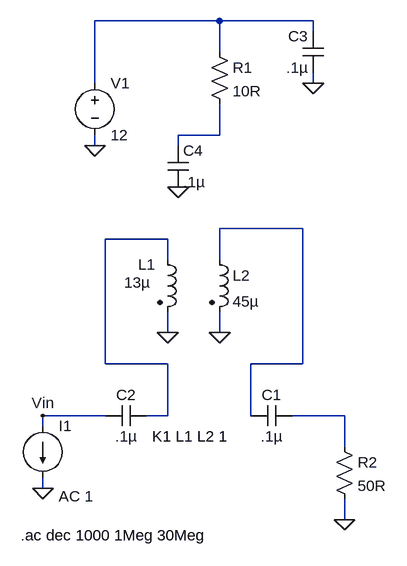
[diagram p0: schematic Transformer Z Matching.asc]
Transformer Z Matching.asc, the LTspice schematic file:
Version 4
SHEET 1 880 712
WIRE -16 -96 -208 -96
WIRE 128 -96 -16 -96
WIRE 128 -80 128 -96
WIRE -16 -48 -16 -96
WIRE -208 0 -208 -96
WIRE 128 0 128 -16
WIRE -16 80 -16 32
WIRE -16 80 -80 80
WIRE -208 96 -208 80
WIRE -80 96 -80 80
WIRE 112 224 -16 224
WIRE -96 240 -192 240
WIRE -96 272 -96 240
WIRE -16 272 -16 224
WIRE -96 384 -96 352
WIRE -16 384 -16 352
WIRE -192 432 -192 240
WIRE -96 432 -192 432
WIRE 112 432 112 224
WIRE 112 432 32 432
WIRE -192 512 -288 512
WIRE -96 512 -96 432
WIRE -96 512 -128 512
WIRE 32 512 32 432
WIRE 176 512 96 512
WIRE -288 528 -288 512
WIRE 176 560 176 512
WIRE -288 624 -288 608
WIRE 176 672 176 640
FLAG -208 96 0
FLAG 128 0 0
FLAG -80 160 0
FLAG 176 672 0
FLAG -288 624 0
FLAG -288 512 Vin
FLAG -96 384 0
FLAG -16 384 0
SYMBOL ind2 -112 256 R0
WINDOW 0 -29 23 Left 2
WINDOW 3 -51 51 Left 2
SYMATTR InstName L1
SYMATTR Value 13µ
SYMATTR Type ind
SYMBOL ind2 -32 256 R0
SYMATTR InstName L2
SYMATTR Value 45µ
SYMATTR Type ind
SYMBOL cap 32 528 R270
WINDOW 0 32 32 VTop 2
WINDOW 3 0 32 VBottom 2
SYMATTR InstName C1
SYMATTR Value .1µ
SYMBOL cap -192 528 R270
WINDOW 0 32 32 VTop 2
WINDOW 3 0 32 VBottom 2
SYMATTR InstName C2
SYMATTR Value .1µ
SYMBOL voltage -208 -16 R0
WINDOW 123 0 0 Left 2
WINDOW 39 0 0 Left 2
SYMATTR InstName V1
SYMATTR Value 12
SYMBOL cap 144 -16 R180
WINDOW 0 24 56 Left 2
WINDOW 3 24 8 Left 2
SYMATTR InstName C3
SYMATTR Value .1µ
SYMBOL res -32 -64 R0
SYMATTR InstName R1
SYMATTR Value 10R
SYMBOL cap -96 96 R0
SYMATTR InstName C4
SYMATTR Value .1µ
SYMBOL res 160 544 R0
SYMATTR InstName R2
SYMATTR Value 50R
SYMBOL current -288 528 R0
WINDOW 123 24 108 Left 2
WINDOW 39 0 0 Left 0
SYMATTR InstName I1
SYMATTR Value ""
SYMATTR Value2 AC 1
TEXT -120 544 Left 2 !K1 L1 L2 1
TEXT -322 696 Left 2 !.ac dec 1000 1Meg 30Meg

The netlist it stands for:
* Transformer Z Matching.asc
L1 N004 0 13µ
L2 N003 0 45µ
C1 N003 N005 .1µ
C2 Vin N004 .1µ
V1 N001 0 12
C3 0 N001 .1µ
R1 N001 N002 10R
C4 N002 0 .1µ
R2 N005 0 50R
I1 Vin 0 AC 1
K1 L1 L2 1
.ac dec 1000 1Meg 30Meg
.backanno
.end